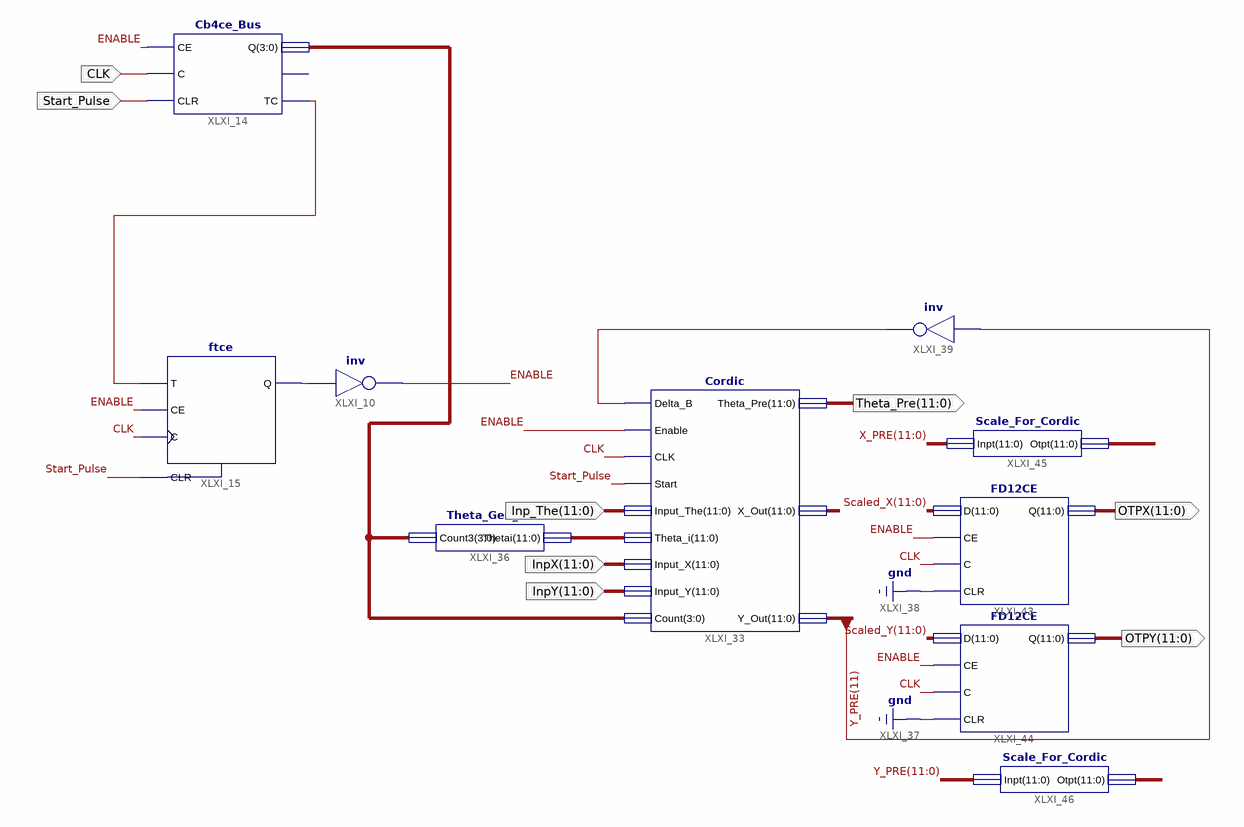
[diagram p0: schematic sheet 1]
// Xilinx ISE schematic Main_T.sch (spartan3e) as structural Verilog: 10 symbols, 8 ports
module Main_T (
  input  Start_Pulse,
  input  CLK,
  input  [11:0] InpY,
  input  [11:0] InpX,
  input  [11:0] Inp_The,
  output [11:0] Theta_Pre,
  output [11:0] OTPX,
  output [11:0] OTPY
);

  wire ENABLE, XLXN_15, XLXN_56, XLXN_220;
  wire [3:0] XLXN_206;
  wire [11:0] Scaled_X, Scaled_Y, X_PRE, XLXN_205, Y_PRE;

  Cb4ce_Bus XLXI_14 (.CE(ENABLE), .C(CLK), .CLR(Start_Pulse), .Q(XLXN_206), .TC(XLXN_56));  // open: CEO
  ftce XLXI_15 (.C(CLK), .CE(ENABLE), .CLR(Start_Pulse), .T(XLXN_56), .Q(XLXN_15));
  not XLXI_10 (ENABLE, XLXN_15);
  Cordic XLXI_33 (
    .Delta_B(XLXN_220), .Enable(ENABLE), .CLK(CLK), .Start(Start_Pulse), .Input_The(Inp_The),
    .Theta_i(XLXN_205), .Input_X(InpX), .Input_Y(InpY), .Count(XLXN_206), .Theta_Pre(Theta_Pre),
    .X_Out(X_PRE), .Y_Out(Y_PRE));
  Theta_Gen_12 XLXI_36 (.Count3(XLXN_206), .Thetai(XLXN_205));
  not XLXI_39 (XLXN_220, Y_PRE[11]);
  FD12CE XLXI_43 (.D(Scaled_X), .CE(ENABLE), .C(CLK), .CLR(1'b0), .Q(OTPX));
  FD12CE XLXI_44 (.D(Scaled_Y), .CE(ENABLE), .C(CLK), .CLR(1'b0), .Q(OTPY));
  Scale_For_Cordic XLXI_45 (.Inpt(X_PRE), .Otpt(Scaled_X));
  Scale_For_Cordic XLXI_46 (.Inpt(Y_PRE), .Otpt(Scaled_Y));
endmodule
